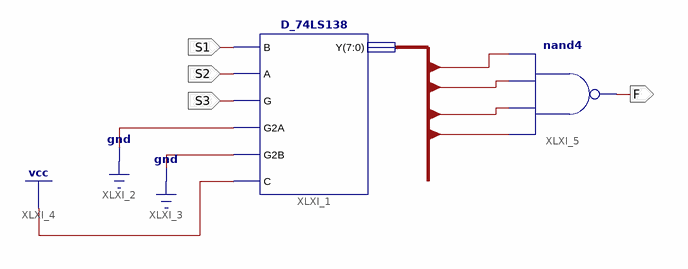
[diagram p0: schematic sheet 1]
// Xilinx ISE schematic Lamp.sch (kintex7) as structural Verilog: 2 symbols, 4 ports
module Lamp (
  input  S1,
  input  S2,
  input  S3,
  output F
);

  wire XLXN_11, XLXN_12, XLXN_13, XLXN_14;
  wire [7:0] XLXN_7;

  D_74LS138 XLXI_1 (.B(S1), .A(S2), .G(S3), .G2A(1'b0), .G2B(1'b0), .C(1'b1), .Y(XLXN_7));
  nand XLXI_5 (F, XLXN_11, XLXN_14, XLXN_13, XLXN_12);
endmodule
